# Altium schematic sheet Sheet_24V_PWR.SchDoc: Smart IoT Wallswitch
size A4; Author: Bc. Miroslav KAŽIMÍR; DrawnBy: Bc. Miroslav Kažimír; DocumentNumber: 24V to 5V DC/DC converter; SheetNumber: 1; SheetTotal: 1
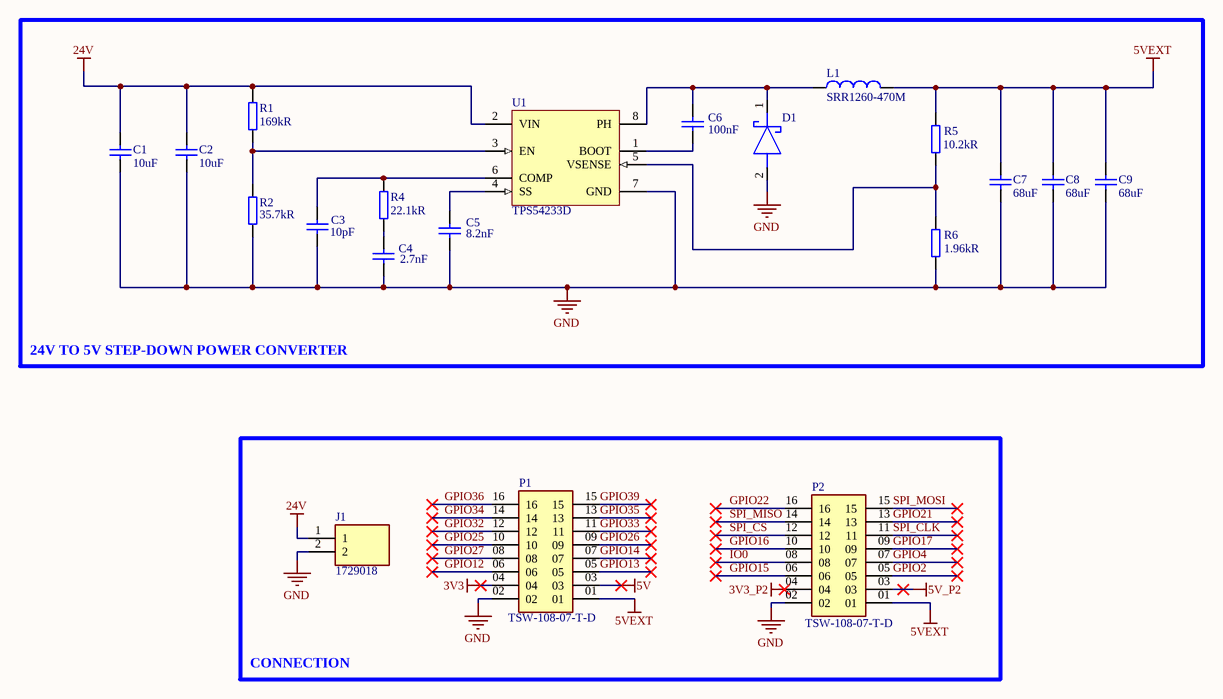
[diagram p0: Sheet_24V_PWR.SchDoc]

## Parts
C1  Capacitance: 10uF  [FP-C3225-250-0_4-IPC_A]  (hidden comment: C1210C106M5RACTU)
C2  Capacitance: 10uF  [FP-C3225-250-0_4-IPC_A]  (hidden comment: C1210C106M5RACTU)
C3  Capacitance: 10pF  [FP-C0805C-DN-IPC_A]  (hidden comment: C0805C100J5GACTU)
C4  Capacitance: 2.7nF  [FP-C2012-060-0_2-IPC_A]  (hidden comment: C2012C0G1H272J060AA)
C5  Capacitance: 8.2nF  [FP-C0805C-DN-IPC_A]  (hidden comment: C0805C822K4RACTU)
C6  Capacitance: 100nF  [FP-C0805C-DN-IPC_A]  (hidden comment: C0805C104K8RACTU)
C7  Capacitance: 68uF  [FP-C3216-160-0_3-IPC_A]  (hidden comment: C3216X5R1A686M160AC)
C8  Capacitance: 68uF  [FP-C3216-160-0_3-IPC_A]  (hidden comment: C3216X5R1A686M160AC)
C9  Capacitance: 68uF  [FP-C3216-160-0_3-IPC_A]  (hidden comment: C3216X5R1A686M160AC)
D1  SS2PH10-M3/84A  [DO-220AA]  (value not drawn)
J1  1729018  [1729018]
L1  SRR1260-470M  [SRR1260470M]
P1  TSW-108-07-T-D  [SAMTEC_TSW-108-07-T-D]
P2  TSW-108-07-T-D  [SAMTEC_TSW-108-07-T-D]
R1  Resistance: 169kR  [RESC2013X70X40LL20T20]  (hidden comment: ERJ-6ENF1693V)
R2  Resistance: 35.7kR  [RESC0805(2012)_L]  (hidden comment: CR0805-FX-3572ELF)
R4  Resistance: 22.1kR  [RESC2012X60N]  (hidden comment: CR0805-FX-2212ELF)
R5  Resistance: 10.2kR  [RESC2012X60N]  (hidden comment: CR0805-FX-1022ELF)
R6  Resistance: 1.96kR  [RESC2013X50X30LL20T20]  (hidden comment: CRCW08051K96FKEA)
U1  TPS54233D  [D0008A_L]

## Blocks framed on the sheet
24V TO 5V STEP-DOWN POWER CONVERTER: C1-C9 D1 L1 R1 R2 R4-R6 U1
CONNECTION: J1 P1 P2

## Nets
3V3: P1.04
3V3_P2: P2.04
5V: P1.03
5V_P2: P2.03
5VEXT: C7.1 C8.1 C9.1 L1.2 P1.01 P2.01 R5.1
24V: C1.1 C2.1 J1.1 R1.1 U1.2(VIN)
GND: C1.2 C2.2 C3.2 C4.2 C5.2 C7.2 C8.2 C9.2 D1.2(A) J1.2 P1.02 P2.02 R2.2 R6.2 U1.7(GND)
GPIO2: P2.05
GPIO4: P2.07
GPIO12: P1.06
GPIO13: P1.05
GPIO14: P1.07
GPIO15: P2.06
GPIO16: P2.10
GPIO17: P2.09
GPIO21: P2.13
GPIO22: P2.16
GPIO25: P1.10
GPIO26: P1.09
GPIO27: P1.08
GPIO32: P1.12
GPIO33: P1.11
GPIO34: P1.14
GPIO35: P1.13
GPIO36: P1.16
GPIO39: P1.15
IO0: P2.08
SPI_CLK: P2.11
SPI_CS: P2.12
SPI_MISO: P2.14
SPI_MOSI: P2.15
NetC3_1: C3.1 R4.1 U1.6(COMP)
NetC4_1: C4.1 R4.2
NetC5_1: C5.1 U1.4(SS)
NetC6_1: C6.1 D1.1(K) L1.1 U1.8(PH)
NetC6_2: C6.2 U1.1(BOOT)
NetR1_2: R1.2 R2.1 U1.3(EN)
NetR5_2: R5.2 R6.1 U1.5(VSENSE)

## Library data of the parts
C1 C2 = C1210C106M5RACTU: 3225 C 10uF Ceramic Multilayer Capacitor; 50 V; +85degC; X7R Dielectric; +/-20%; Manufacturer: KEMET; Voltage Rating: 50V; Tolerance: 20%; Supplier 1: Mouser; Manufacturer Part Number: C1210C106M5RACTU; RoHS: Yes; Category: Ceramic Capacitors; Stock 1: 269; Pricing 1: 1=1,11000, 10=0,85000, 50=0,85000, 100=0,60800, 500=0,54200, 1000=0,47500, 10000=0,47500 (USD); Mount: Surface Mount; Case/Package: 1210; Case Code (Metric): 3225; Case Code (Imperial): 1210; Weight: 0.000564oz; Dielectric Material: Ceramic; Min Operating Temperature: -55°C; Max Operating Temperature: 125°C; Packaging: Tape and Reel; Voltage: 50V; Dielectric: X7R; Termination: SMD/SMT; Voltage Rating (DC): 50V; Package Quantity: 1000; Length: 3.2mm; Width: 0.098inch; Height: 2.5mm; Thickness: 0.11inch; Depth: 2.5mm; RoHS Compliant: Yes; ComponentLink1URL: http://www.farnell.com/datasheets/2746479.pdf?src-supplier=Farnell; ComponentLink1Description: http://www.farnell.com/datasheets/2746479.pdf?src-supplier=Farnell; ComponentLink2URL: http://uk.rs-online.com/webdocs/1515/0900766b8151523a.pdf?src-supplier=RSComponents; ComponentLink2Description: http://uk.rs-online.com/webdocs/1515/0900766b8151523a.pdf?src-supplier=RSComponents; ComponentLink3URL: http://www.farnell.com/datasheets/2323917.pdf?src-supplier=Farnell; ComponentLink3Description: http://www.farnell.com/datasheets/2323917.pdf?src-supplier=Farnell; ComponentLink4URL: http://www.mouser.com/ds/2/212/KEM_C1002_X7R_SMD-357932.pdf?src-supplier=Mouser; ComponentLink4Description: http://www.mouser.com/ds/2/212/KEM_C1002_X7R_SMD-357932.pdf?src-supplier=Mouser; ComponentLink5URL: http://www.kemet.com/Lists/ProductCatalog/Attachments/53/KEM_C1002_X7R_SMD.pdf?src-supplier=Digi-Key; ComponentLink5Description: http://www.kemet.com/Lists/ProductCatalog/Attachments/53/KEM_C1002_X7R_SMD.pdf?src-supplier=Digi-Key; ComponentLink6URL: http://www.farnell.com/datasheets/2746479.pdf?src-supplier=Newark; ComponentLink6Description: http://www.farnell.com/datasheets/2746479.pdf?src-supplier=Newark; ComponentLink7URL: https://api.kemet.com/component-edge/download/datasheet/C1210C106M5RACTU.pdf?src-supplier=Digi-Key; ComponentLink7Description: https://api.kemet.com/component-edge/download/datasheet/C1210C106M5RACTU.pdf?src-supplier=Digi-Key; Supplier Part Number 1: 80-C1210C106M5R
C3 = C0805C100J5GACTU: Cap Ceramic 10pF 50V C0G 5% SMD 0805 125C Plastic T/R; Manufacturer: KEMET; Temperature Coefficient: 30ppm/°C; Dissipation Factor: 0.1%; Supplier 1: Mouser; Manufacturer Part Number: C0805C100J5GACTU; RoHS: Yes; Category: Ceramic Capacitors; Stock 1: 194709; Pricing 1: 1=0,12000, 10=0,04800, 50=0,04800, 100=0,03200, 500=0,02300, 1000=0,01900, 4000=0,01800, 8000=0,01500, 10000=0,01500 (USD); Mount: PCB,Surface Mount; Case/Package: 0805; Number of Pins: 2; Case Code (Metric): 2012; Case Code (Imperial): 0805; Contact Material: Tin; Contact Plating: Tin,Matte; Dielectric Material: Ceramic; Min Operating Temperature: -55°C; Max Operating Temperature: 125°C; Tolerance: 5%; Package Quantity: 4000; Voltage Rating: 50V; Packaging: Tape and Reel; Voltage Rating (DC): 50V; Dielectric: C0G; Termination: SMD/SMT; Voltage: 50V; Series: C0805C; Construction: Flat; Length: 2mm; Width: 1.2mm; Height: 0.78mm; Thickness: 0.035inch; Lead Pitch: 0.75mm; Depth: 1.25mm; Radiation Hardening: No; REACH SVHC: No SVHC; Lead Free: Lead Free; RoHS Compliant: Yes; ComponentLink1URL: https://datasheet.ciiva.com/6177/kem-c1003-c0g-smd-6177333.pdf?src-supplier=Farnell; ComponentLink1Description: https://datasheet.ciiva.com/6177/kem-c1003-c0g-smd-6177333.pdf?src-supplier=Farnell; ComponentLink2URL: https://datasheet.ciiva.com/14609/70095383-14609227.pdf?src-supplier=Allied+Electronics; ComponentLink2Description: https://datasheet.ciiva.com/14609/70095383-14609227.pdf?src-supplier=Allied+Electronics; ComponentLink3URL: https://datasheet.ciiva.com/5423/kem-c1003-c0g-smd-356956-5423483.pdf?src-supplier=Mouser; ComponentLink3Description: https://datasheet.ciiva.com/5423/kem-c1003-c0g-smd-356956-5423483.pdf?src-supplier=Mouser; ComponentLink4URL: https://datasheet.ciiva.com/2988/kem-c1003-c0g-smd-2988556.pdf?src-supplier=Avnet; ComponentLink4Description: https://datasheet.ciiva.com/2988/kem-c1003-c0g-smd-2988556.pdf?src-supplier=Avnet; Supplier Part Number 1: 80-C0805C100J5G
C4 = C2012C0G1H272J060AA: Cap Ceramic 0.0027uF 50V C0G 5% SMD 0805 125C Paper T/R; Manufacturer: TDK; Temperature Coefficient: 30ppm/°C; Supplier 1: Mouser; Manufacturer Part Number: C2012C0G1H272J060AA; RoHS: Yes; Category: Ceramic Capacitors; Stock 1: 7246; Pricing 1: 1=0,21000, 10=0,14700, 50=0,14700, 100=0,07000, 500=0,04900, 1000=0,04100, 2000=0,03800, 4000=0,03400, 8000=0,03100, 10000=0,03100 (USD); Mount: Surface Mount; Case/Package: 0805; Case Code (Imperial): 0805; Case Code (Metric): 2012; Weight: 0.000194oz; Dielectric Material: Ceramic; Min Operating Temperature: -55°C; Max Operating Temperature: 125°C; Packaging: Tape and Reel; Voltage Rating: 50V; Tolerance: 5%; Voltage Rating (DC): 50V; Termination: SMD/SMT; Construction: Flat; Package Quantity: 1; Dielectric: C0G; Voltage: 50V; Series: C; Length: 2mm; Width: 1.25mm; Height: 0.6mm; Thickness: 0.028inch; Depth: 1.25mm; Radiation Hardening: No; RoHS Compliant: Yes; Lead Free: Lead Free; ComponentLink1URL: https://datasheet.ciiva.com/24219/c2012c0g1h272j060aa-264945-24219106.pdf?src-supplier=Mouser; ComponentLink1Description: https://datasheet.ciiva.com/24219/c2012c0g1h272j060aa-264945-24219106.pdf?src-supplier=Mouser; ComponentLink2URL: https://datasheet.ciiva.com/11788/0900766b80c1bb00-11788104.pdf?src-supplier=RSComponents; ComponentLink2Description: https://datasheet.ciiva.com/11788/0900766b80c1bb00-11788104.pdf?src-supplier=RSComponents; ComponentLink3URL: https://datasheet.ciiva.com/26936/getdatasheetpartid-781773-26936472.pdf?src-supplier=Verical; ComponentLink3Description: https://datasheet.ciiva.com/26936/getdatasheetpartid-781773-26936472.pdf?src-supplier=Verical; ComponentLink4URL: https://datasheet.ciiva.com/6291/tdkmlcccaprange-6291707.pdf?src-supplier=Digi-Key; ComponentLink4Description: https://datasheet.ciiva.com/6291/tdkmlcccaprange-6291707.pdf?src-supplier=Digi-Key; ComponentLink5URL: https://datasheet.ciiva.com/6291/tdkmlcccaprange-6291704.pdf?src-supplier=Digi-Key; ComponentLink5Description: https://datasheet.ciiva.com/6291/tdkmlcccaprange-6291704.pdf?src-supplier=Digi-Key; ComponentLink6URL: https://datasheet.ciiva.com/6291/tdkmlcccaprange-6291710.pdf?src-supplier=Digi-Key; ComponentLink6Description: https://datasheet.ciiva.com/6291/tdkmlcccaprange-6291710.pdf?src-supplier=Digi-Key; Supplier Part Number 1: 810-C2012C0G1H272J-1
C5 = C0805C822K4RACTU: Capacitor, Ceramic, 8.2nF, 16VDC, 10-% Tol, 10+% Tol, X7R-TC Code, -15, 15%-TC RoHS Compliant: Yes; Manufacturer: KEMET; Tolerance: 10%; Voltage Rating: 16V; Dielectric: X7R; Dissipation Factor: 5%; Supplier 1: Mouser; Manufacturer Part Number: C0805C822K4RACTU; RoHS: Yes; Category: Ceramic Capacitors; Stock 1: 3964; Pricing 1: 1=0,31000, 10=0,21500, 50=0,21500, 100=0,12200, 1000=0,07500, 10000=0,06600 (USD); Mount: Surface Mount; Case/Package: 0805; Case Code (Metric): 2012; Case Code (Imperial): 0805; Dielectric Material: Ceramic; Min Operating Temperature: -55°C; Max Operating Temperature: 125°C; Packaging: Tape and Reel; Package Quantity: 4000; Voltage Rating (DC): 16V; Termination: SMD/SMT; Series: C; Length: 2mm; Width: 0.049inch; Height: 0.78mm; Thickness: 0.035inch; Lead Pitch: 0.75mm; Depth: 1.25mm; RoHS Compliant: Yes; ComponentLink1URL: http://www.mouser.com/ds/2/212/KEM_C1002_X7R_SMD-1102033.pdf?src-supplier=Mouser; ComponentLink1Description: http://www.mouser.com/ds/2/212/KEM_C1002_X7R_SMD-1102033.pdf?src-supplier=Mouser; ComponentLink2URL: http://components.arrow.com/part/dataview/3450560S8615350N7429?src-supplier=Arrow+Electronics; ComponentLink2Description: http://components.arrow.com/part/dataview/3450560S8615350N7429?src-supplier=Arrow+Electronics; ComponentLink3URL: https://search.kemet.com/component-edge/download/datasheet/C0805C822K4RACTU.pdf?src-supplier=Digi-Key; ComponentLink3Description: https://search.kemet.com/component-edge/download/datasheet/C0805C822K4RACTU.pdf?src-supplier=Digi-Key; Supplier Part Number 1: 80-C0805C822K4R
C6 = C0805C104K8RACTU: Cap Ceramic 0.1uF 10V X7R 10% SMD 0805 125°C Paper T/R; Manufacturer: KEMET; Dissipation Factor: 5%; Supplier 1: Mouser; Manufacturer Part Number: C0805C104K8RACTU; RoHS: Yes; Category: Ceramic Capacitors; Stock 1: 26277; Pricing 1: 1=0,18000, 10=0,08600, 50=0,08600, 100=0,08600, 1000=0,08600, 10000=0,08500 (USD); Mount: Surface Mount; Case/Package: 0805; Case Code (Imperial): 0805; Case Code (Metric): 2012; Dielectric Material: Ceramic; Min Operating Temperature: -55°C; Max Operating Temperature: 125°C; Package Quantity: 1; Tolerance: 10%; Packaging: Tape and Reel; Voltage Rating: 10V; Voltage Rating (DC): 10V; Dielectric: X7R; Termination: SMD/SMT; Series: C; Length: 2mm; Width: 1.2mm; Height: 0.9mm; Lead Pitch: 0.75mm; Thickness: 0.035inch; Depth: 1.25mm; REACH SVHC: No SVHC; RoHS Compliant: Yes; ComponentLink1URL: http://components.arrow.com/part/dataview/2091095S5871853N7429?src-supplier=Arrow+Electronics; ComponentLink1Description: http://components.arrow.com/part/dataview/2091095S5871853N7429?src-supplier=Arrow+Electronics; ComponentLink2URL: http://www.farnell.com/datasheets/2323363.pdf?src-supplier=Farnell; ComponentLink2Description: http://www.farnell.com/datasheets/2323363.pdf?src-supplier=Farnell; ComponentLink3URL: http://www.mouser.com/ds/2/212/KEM_C1002_X7R_SMD-1102033.pdf?src-supplier=Mouser; ComponentLink3Description: http://www.mouser.com/ds/2/212/KEM_C1002_X7R_SMD-1102033.pdf?src-supplier=Mouser; ComponentLink4URL: http://www.farnell.com/datasheets/2746328.pdf?src-supplier=Farnell; ComponentLink4Description: http://www.farnell.com/datasheets/2746328.pdf?src-supplier=Farnell; ComponentLink5URL: http://www.farnell.com/datasheets/2746328.pdf?src-supplier=Newark; ComponentLink5Description: http://www.farnell.com/datasheets/2746328.pdf?src-supplier=Newark; ComponentLink6URL: https://api.kemet.com/component-edge/download/datasheet/C0805C104K8RACTU.pdf?src-supplier=Digi-Key; ComponentLink6Description: https://api.kemet.com/component-edge/download/datasheet/C0805C104K8RACTU.pdf?src-supplier=Digi-Key; Supplier Part Number 1: 80-C0805C104K8R
C7-C9 = C3216X5R1A686M160AC: C Series 1206 68 uF 10 V ±20 % Tolerance X5R SMT Multilayer Ceramic Capacitor; Manufacturer: TDK; Tolerance: 20%; Voltage Rating: 10V; Supplier 1: Mouser; Manufacturer Part Number: C3216X5R1A686M160AC; RoHS: Yes; Category: Ceramic Capacitors; Stock 1: 21577; Pricing 1: 1=1,39000, 10=0,98700, 50=0,98700, 100=0,84800, 500=0,64600, 1000=0,57000, 2000=0,53100, 4000=0,51500, 10000=0,49900, 24000=0,48400 (USD); Mount: Surface Mount; Case/Package: 1206; Case Code (Metric): 3216; Case Code (Imperial): 1206; Dielectric Material: Ceramic; Min Operating Temperature: -55°C; Max Operating Temperature: 85°C; Package Quantity: 2000; Packaging: Tape and Reel; Termination: SMD/SMT; Resistor Type: Ceramic; Voltage Rating (DC): 10V; Series: C; Dielectric: X5R; Length: 0.126inch; Width: 1.6mm; Height: 1.6mm; Thickness: 0.071inch; Lead Free: Lead Free; RoHS Compliant: Yes; ComponentLink1URL: http://www.mouser.com/ds/2/400/tdk_mlcc_commercial_general_en-542463.pdf?src-supplier=Mouser; ComponentLink1Description: http://www.mouser.com/ds/2/400/tdk_mlcc_commercial_general_en-542463.pdf?src-supplier=Mouser; ComponentLink2URL: http://www.farnell.com/datasheets/2792994.pdf?src-supplier=Farnell; ComponentLink2Description: http://www.farnell.com/datasheets/2792994.pdf?src-supplier=Farnell; ComponentLink3URL: https://product.tdk.com/info/en/documents/chara_sheet/C3216X5R1A686M160AC.pdf?src-supplier=Digi-Key; ComponentLink3Description: https://product.tdk.com/info/en/documents/chara_sheet/C3216X5R1A686M160AC.pdf?src-supplier=Digi-Key; ComponentLink4URL: http://www.farnell.com/datasheets/2370676.pdf?src-supplier=Newark; ComponentLink4Description: http://www.farnell.com/datasheets/2370676.pdf?src-supplier=Newark; ComponentLink5URL: https://product.tdk.com/en/products/common/pdf/mlcc_partnumber_description.pdf?src-supplier=Digi-Key; ComponentLink5Description: https://product.tdk.com/en/products/common/pdf/mlcc_partnumber_description.pdf?src-supplier=Digi-Key; ComponentLink6URL: http://product.tdk.com/en/catalog/datasheets/mlcc_commercial_general_en.pdf?src-supplier=Avnet; ComponentLink6Description: http://product.tdk.com/en/catalog/datasheets/mlcc_commercial_general_en.pdf?src-supplier=Avnet; Supplier Part Number 1: 810-C3216X5R1A686M1C
D1 = SS2PH10-M3/84A: DIODE SCHOTTKY 100V 2A DO220AA; Manufacturer: Vishay; Max Reverse Current: 1uA; Peak Non-Repetitive Surge Current: 50A; Element Configuration: Single; Forward Voltage: 800mV; Supplier 1: Mouser; Manufacturer Part Number: SS2PH10-M3/84A; RoHS: Yes; Category: Rectifier Diodes; Stock 1: 5780; Pricing 1: 1=0,48000, 10=0,39800, 50=0,39800, 100=0,27100, 1000=0,15300, 10000=0,13900 (USD); Mount: Surface Mount; Case/Package: DO-220AA; Number of Pins: 2; Contact Plating: Tin,Matte; Min Operating Temperature: -55°C; Max Operating Temperature: 175°C; Packaging: Tape and Reel; Forward Current: 2A; Package Quantity: 1; Average Rectified Current: 2A; Max Repetitive Reverse Voltage (Vrrm): 100V; Max Reverse Voltage (DC): 100V; Max Surge Current: 50A; Max Forward Surge Current (Ifsm): 50A; Series: eSMP®; Radiation Hardening: No; REACH SVHC: Unknown; RoHS Compliant: Yes; Lead Free: Lead Free; ComponentLink1URL: https://datasheet.ciiva.com/18567/ss2ph920&20ss2ph10-18567489.pdf?src-supplier=Digi-Key; ComponentLink1Description: https://datasheet.ciiva.com/18567/ss2ph920&20ss2ph10-18567489.pdf?src-supplier=Digi-Key; ComponentLink2URL: https://datasheet.ciiva.com/7962/ss2ph9-7962425.pdf?src-supplier=Element14; ComponentLink2Description: https://datasheet.ciiva.com/7962/ss2ph9-7962425.pdf?src-supplier=Element14; ComponentLink3URL: https://datasheet.ciiva.com/22695/1911775-22695932.pdf?src-supplier=Element14; ComponentLink3Description: https://datasheet.ciiva.com/22695/1911775-22695932.pdf?src-supplier=Element14; ComponentLink4URL: https://datasheet.ciiva.com/8289/ss2ph9-8289129.pdf?src-supplier=Avnet; ComponentLink4Description: https://datasheet.ciiva.com/8289/ss2ph9-8289129.pdf?src-supplier=Avnet; ComponentLink5URL: https://datasheet.ciiva.com/13948/ss2ph9-13948536.pdf?src-supplier=Digi-Key; ComponentLink5Description: https://datasheet.ciiva.com/13948/ss2ph9-13948536.pdf?src-supplier=Digi-Key; ComponentLink6URL: https://datasheet.ciiva.com/15045/ss2ph9ss2ph10-15045638.pdf?src-supplier=Digi-Key; ComponentLink6Description: https://datasheet.ciiva.com/15045/ss2ph9ss2ph10-15045638.pdf?src-supplier=Digi-Key; Supplier Part Number 1: 625-SS2PH10-M3
J1 = 1729018: 间距5mm 2pin 10A 300V 可拼接 螺钉式 直插; Manufacturer: Phoenix Contact; Current Rating: 13.5A; Number of Positions: 2; Voltage Rating: 400V; Number of Levels: 1; Gender: Male; Max Supply Voltage: 250V; Connector Type: Screw; Wire Gauge (Max): 26AWG; Pitch: 5mm; Stripping Length: 6mm; Approvals: UL,CSA,cULus,CB,EAC; Supplier 1: Mouser; Manufacturer Part Number: 1729018; RoHS: Yes; Category: Terminal Blocks; Stock 1: 15002; Pricing 1: 1=1,21000, 10=1,17000, 50=1,12000, 100=1,08000, 250=1,01000, 500=0,92900, 1000=0,85800, 2500=0,81800, 5000=0,76700, 10000=0,76700 (USD); Mount: Through Hole; Number of Pins: 2; Weight: 0.06949oz; Color: Green; Material: Polyamide; Housing Color: Green; Housing Material: Polyamide; Contact Material: Tin; Insulation Material: Nylon; Package Quantity: 50; Packaging: Bulk; Termination: Screw; Number of Positions Per Level: 2; Current: 10A; Number of Contacts: 2; Series: COMBICON MKDSN; Number of Rows: 1; Max Current Rating: 13.5A; Number of Poles: 2; Voltage: 300V; Number of Circuits: 2; Orientation: Straight; Length: 8.1mm; Width: 13.5mm; Height: 13.5mm; Wire Gauge (Min): 26AWG; Depth: 8.1mm; Wire/Cable Gauge: 26AWG; Radiation Hardening: No; REACH SVHC: Unknown; RoHS Compliant: Yes; Lead Free: Lead Free; Flammability Rating: UL94 V-0; ComponentLink1URL: https://datasheet.ciiva.com/16071/1729018-16071814.pdf?src-supplier=Onlinecomponents.com; ComponentLink1Description: https://datasheet.ciiva.com/16071/1729018-16071814.pdf?src-supplier=Onlinecomponents.com; ComponentLink2URL: https://datasheet.ciiva.com/15169/getdatasheetpartid-177860-15169643.pdf?src-supplier=Verical; ComponentLink2Description: https://datasheet.ciiva.com/15169/getdatasheetpartid-177860-15169643.pdf?src-supplier=Verical; ComponentLink3URL: https://datasheet.ciiva.com/832/1729018-832055.pdf?src-supplier=Digi-Key; ComponentLink3Description: https://datasheet.ciiva.com/832/1729018-832055.pdf?src-supplier=Digi-Key; ComponentLink4URL: https://datasheet.ciiva.com/14607/70054375-14607356.pdf?src-supplier=Allied+Electronics; ComponentLink4Description: https://datasheet.ciiva.com/14607/70054375-14607356.pdf?src-supplier=Allied+Electronics; ComponentLink5URL: https://datasheet.ciiva.com/33105/1729018-33105978.pdf?src-supplier=Today+Components; ComponentLink5Description: https://datasheet.ciiva.com/33105/1729018-33105978.pdf?src-supplier=Today+Components; Supplier Part Number 1: 651-1729018
L1 = SRR1260-470M: Inductor Power Shielded Wirewound 47uH 20% 100KHz 22Q-Factor Ferrite 2.6A 86mOhm DCR T/R; Manufacturer: Bourns; Material: Steel; Self Resonant Frequency: 7.63MHz; Saturation Current: 2.5A; DC Resistance (DCR): 86mR; Q Factor: 22; Supplier 1: Mouser; Manufacturer Part Number: SRR1260-470M; RoHS: Yes; Category: Fixed Inductors; Stock 1: 4692; Pricing 1: 1=1,36000, 10=1,02000, 50=1,02000, 100=0,91300, 1000=0,69900, 10000=0,52900 (USD); Mount: Surface Mount; Case/Package: 1260; Core Material: Ferrite; Min Operating Temperature: -40°C; Max Operating Temperature: 125°C; Tolerance: 20%; Inductance: 47uH; Max DC Current: 2.6A; Series: SRR1260; Inductance Tolerance: 20%; Packaging: Tape and Reel; Package Quantity: 600; Current Rating: 2.6A; Shielding: Shielded; Test Frequency: 100kHz; Termination: SMD/SMT; RMS Current (Irms): 2.6A; Resistor Type: Wirewound; DC Current: 2.6A; Frequency: 7.63MHz; Resistance: 86MR; Sample Rate (Hz): 100kHz; Length: 12.5mm; Width: 12.5mm; Height: 6mm; Depth: 12.8mm; Height - Seated (Max): 0.256inch; Radiation Hardening: No; RoHS Compliant: Yes; REACH SVHC: No SVHC; Military Standard: Not; ComponentLink1URL: https://datasheet.ciiva.com/11799/0900766b80defded-11799944.pdf?src-supplier=RSComponents; ComponentLink1Description: https://datasheet.ciiva.com/11799/0900766b80defded-11799944.pdf?src-supplier=RSComponents; ComponentLink2URL: https://datasheet.ciiva.com/1062/srr1260-1062578.pdf?src-supplier=Digi-Key; ComponentLink2Description: https://datasheet.ciiva.com/1062/srr1260-1062578.pdf?src-supplier=Digi-Key; ComponentLink3URL: https://datasheet.ciiva.com/1062/srr1260-1062579.pdf?src-supplier=Digi-Key; ComponentLink3Description: https://datasheet.ciiva.com/1062/srr1260-1062579.pdf?src-supplier=Digi-Key; ComponentLink4URL: https://datasheet.ciiva.com/1062/srr1260-1062580.pdf?src-supplier=Digi-Key; ComponentLink4Description: https://datasheet.ciiva.com/1062/srr1260-1062580.pdf?src-supplier=Digi-Key; ComponentLink5URL: https://datasheet.ciiva.com/8517/srr1260-8517158.pdf?src-supplier=Avnet; ComponentLink5Description: https://datasheet.ciiva.com/8517/srr1260-8517158.pdf?src-supplier=Avnet; ComponentLink6URL: https://datasheet.ciiva.com/17111/70277056-17111735.pdf?src-supplier=Allied+Electronics; ComponentLink6Description: https://datasheet.ciiva.com/17111/70277056-17111735.pdf?src-supplier=Allied+Electronics; ComponentLink7URL: https://datasheet.ciiva.com/46384/1430852-46384136.pdf?src-supplier=Element14; ComponentLink7Description: https://datasheet.ciiva.com/46384/1430852-46384136.pdf?src-supplier=Element14; ComponentLink8URL: https://datasheet.ciiva.com/6161/1430852-6161177.pdf?src-supplier=Farnell; ComponentLink8Description: https://datasheet.ciiva.com/6161/1430852-6161177.pdf?src-supplier=Farnell; ComponentLink9URL: https://datasheet.ciiva.com/7849/1430852-7849786.pdf?src-supplier=Element14; ComponentLink9Description: https://datasheet.ciiva.com/7849/1430852-7849786.pdf?src-supplier=Element14; ComponentLink10URL: https://datasheet.ciiva.com/48684/srr1260-48684894.pdf?src-supplier=Avnet; ComponentLink10Description: https://datasheet.ciiva.com/48684/srr1260-48684894.pdf?src-supplier=Avnet; ComponentLink11URL: https://datasheet.ciiva.com/7307/1914016-7307759.pdf?src-supplier=Newark; ComponentLink11Description: https://datasheet.ciiva.com/7307/1914016-7307759.pdf?src-supplier=Newark; ComponentLink12URL: https://datasheet.ciiva.com/48690/001056651-da-01-en-mag-abge-l-ind-srr1260-470m-47uh-2-6a-48690779.pdf?src-supplier=Conrad; ComponentLink12Description: https://datasheet.ciiva.com/48690/001056651-da-01-en-mag-abge-l-ind-srr1260-470m-47uh-2-6a-48690779.pdf?src-supplier=Conrad; Supplier Part Number 1: 652-SRR1260-470M
P1 P2 = TSW-108-07-T-D: Conn Unshrouded Header HDR 16 POS 2.54mm Solder ST Thru-Hole Bulk; Manufacturer: Samtec; Gender: Male; Number of Contacts: 16; Max Current Rating: 7.6A; Max Voltage Rating (AC): 550V; Connector Type: Male Pin; Row Spacing: 0.1inch; Supplier 1: Mouser; Manufacturer Part Number: TSW-108-07-T-D; RoHS: Yes; Category: Connectors; Stock 1: 9900; Pricing 1: 1=1,38000, 10=1,24000, 50=1,24000, 100=1,07000, 500=0,89200, 1000=0,76400, 2500=0,70700, 5000=0,67800, 10000=0,66200, 25000=0,64700 (USD); Mount: Through Hole; Contact Material: Bronze; Contact Plating: Tin; Housing Material: Polyester; Housing Color: Black; Color: Black; Min Operating Temperature: -55°C; Max Operating Temperature: 105°C; Number of Rows: 2; Termination: Solder; Packaging: Bulk; Orientation: Straight; Number of Positions: 16; Package Quantity: 1; Length: 20.32mm; Width: 5.08mm; Pitch: 2.54mm; Depth: 5.08mm; Contact Mating Length: 0.23inch; Radiation Hardening: No; REACH SVHC: No SVHC; Lead Free: Lead Free; ComponentLink1URL: https://datasheet.ciiva.com/6886/tsw-xxx-xx-xxx-x-xx-xxx-mkt-6886341.pdf?src-supplier=Digi-Key; ComponentLink1Description: https://datasheet.ciiva.com/6886/tsw-xxx-xx-xxx-x-xx-xxx-mkt-6886341.pdf?src-supplier=Digi-Key; ComponentLink2URL: https://datasheet.ciiva.com/10267/htsw-th-10267287.pdf?src-supplier=Avnet; ComponentLink2Description: https://datasheet.ciiva.com/10267/htsw-th-10267287.pdf?src-supplier=Avnet; ComponentLink3URL: https://datasheet.ciiva.com/10265/htsw-th-10265257.pdf?src-supplier=Avnet; ComponentLink3Description: https://datasheet.ciiva.com/10265/htsw-th-10265257.pdf?src-supplier=Avnet; Supplier Part Number 1: 200-TSW10807TD
R1 = ERJ-6ENF1693V: Res Thick Film 0805 169K Ohm 1% 1/8W ±100ppm/°C Molded SMD Punched Carrier T/R; Manufacturer: Panasonic; Power Rating: 125mW; Voltage Rating: 150V; Supplier 1: Mouser; Manufacturer Part Number: ERJ-6ENF1693V; RoHS: Yes; Category: Chip SMD Resistors; Stock 1: 26412; Pricing 1: 1=0,10000, 10=0,06400, 50=0,06400, 100=0,03100, 1000=0,01700, 10000=0,01100 (USD); Mount: Surface Mount; Case/Package: 0805; Contact Plating: Tin; Case Code (Imperial): 0805; Case Code (Metric): 2012; Min Operating Temperature: -55°C; Max Operating Temperature: 155°C; Tolerance: 1%; Resistor Type: Thick Film; Temperature Coefficient: 100ppm/°C; Packaging: Tape and Reel; Package Quantity: 1; Number of Terminations: 2; Termination: Solder; Max Power Dissipation: 125mW; Voltage Rating (DC): 150V; Features: Automotive AEC-Q200; Series: ERJ; Resistance Tolerance: 1%; Technology: THICK FILM; Construction: Rectangular; Length: 2mm; Width: 1.2mm; Height: 0.6mm; Depth: 1.25mm; Radiation Hardening: No; REACH SVHC: No SVHC; Military Standard: Not; Lead Free: Lead Free; RoHS Compliant: Yes; ComponentLink1URL: https://datasheet.ciiva.com/16759/70260748-16759800.pdf?src-supplier=Allied+Electronics; ComponentLink1Description: https://datasheet.ciiva.com/16759/70260748-16759800.pdf?src-supplier=Allied+Electronics; ComponentLink2URL: https://datasheet.ciiva.com/22672/1678782-22672876.pdf?src-supplier=Element14; ComponentLink2Description: https://datasheet.ciiva.com/22672/1678782-22672876.pdf?src-supplier=Element14; ComponentLink3URL: https://datasheet.ciiva.com/16764/70260748-16764845.pdf?src-supplier=Allied+Electronics; ComponentLink3Description: https://datasheet.ciiva.com/16764/70260748-16764845.pdf?src-supplier=Allied+Electronics; ComponentLink4URL: https://datasheet.ciiva.com/46373/1678782-46373037.pdf?src-supplier=Element14; ComponentLink4Description: https://datasheet.ciiva.com/46373/1678782-46373037.pdf?src-supplier=Element14; ComponentLink5URL: https://datasheet.ciiva.com/46373/1678782-46373038.pdf?src-supplier=Element14; ComponentLink5Description: https://datasheet.ciiva.com/46373/1678782-46373038.pdf?src-supplier=Element14; Supplier Part Number 1: 667-ERJ-6ENF1693V
R2 = CR0805-FX-3572ELF: Res Thick Film 0805 35.7K Ohm 1% 1/8W 100ppm/C Molded SMD SMD Paper Tape on Plastic Reel; Manufacturer: Bourns; Power Rating: 125mW; Voltage Rating: 150V; Temperature Coefficient: 100ppm/°C; Supplier 1: Mouser; Manufacturer Part Number: CR0805-FX-3572ELF; RoHS: Yes; Category: Chip SMD Resistors; Stock 1: 40799; Pricing 1: 1=0,10000, 10=0,05000, 50=0,05000, 100=0,02100, 1000=0,01000, 10000=0,00500 (USD); Mount: Surface Mount; Case/Package: 0805; Case Code (Metric): 2012; Case Code (Imperial): 0805; Contact Plating: Tin; Min Operating Temperature: -55°C; Max Operating Temperature: 155°C; Packaging: Tape and Reel; Tolerance: 1%; Package Quantity: 5000; Resistor Type: Thick Film; Number of Terminations: 2; Termination: SMD/SMT; Max Power Dissipation: 125mW; Features: Moisture Resistant; Series: CR0805; Length: 0.079inch; Width: 0.049inch; Height: 0.024inch; Thickness: 508um; Radiation Hardening: No; RoHS Compliant: Yes; ComponentLink1URL: https://datasheet.ciiva.com/14985/chpreztr-14985829.pdf?src-supplier=Digi-Key; ComponentLink1Description: https://datasheet.ciiva.com/14985/chpreztr-14985829.pdf?src-supplier=Digi-Key; ComponentLink2URL: https://datasheet.ciiva.com/5543/chpreztr-5543310.pdf?src-supplier=Mouser; ComponentLink2Description: https://datasheet.ciiva.com/5543/chpreztr-5543310.pdf?src-supplier=Mouser; ComponentLink3URL: https://datasheet.ciiva.com/9121/chpreztr-9121519.pdf?src-supplier=Avnet; ComponentLink3Description: https://datasheet.ciiva.com/9121/chpreztr-9121519.pdf?src-supplier=Avnet; Supplier Part Number 1: 652-CR0805FX-3572ELF
R4 = CR0805-FX-2212ELF: Res Thick Film 0805 22.1K Ohm 1% 1/8W ±100ppm/°C Molded SMD SMD Paper Tape on Plastic Reel; Manufacturer: Bourns; Power Rating: 125mW; Voltage Rating: 150V; Supplier 1: Mouser; Manufacturer Part Number: CR0805-FX-2212ELF; RoHS: Yes; Category: Chip SMD Resistors; Stock 1: 28517; Pricing 1: 1=0,10000, 10=0,02700, 50=0,02700, 100=0,01100, 1000=0,00500, 10000=0,00500 (USD); Mount: Surface Mount; Case/Package: 0805; Contact Plating: Tin; Case Code (Imperial): 0805; Case Code (Metric): 2012; Min Operating Temperature: -55°C; Max Operating Temperature: 155°C; Tolerance: 1%; Resistor Type: Thick Film; Temperature Coefficient: 100ppm/°C; Packaging: Tape and Reel; Package Quantity: 5000; Termination: SMD/SMT; Number of Terminations: 2; Max Power Dissipation: 125mW; Features: Moisture Resistant; Series: CR0805; Construction: Rectangular; Length: 2mm; Width: 1.25mm; Height: 0.024inch; Depth: 1.25mm; Thickness: 508um; Radiation Hardening: No; Military Standard: Not; RoHS Compliant: Yes; ComponentLink1URL: https://datasheet.ciiva.com/18608/chpreztr-18608486.pdf?src-supplier=Digi-Key; ComponentLink1Description: https://datasheet.ciiva.com/18608/chpreztr-18608486.pdf?src-supplier=Digi-Key; ComponentLink2URL: https://datasheet.ciiva.com/18608/chpreztr-18608487.pdf?src-supplier=Digi-Key; ComponentLink2Description: https://datasheet.ciiva.com/18608/chpreztr-18608487.pdf?src-supplier=Digi-Key; ComponentLink3URL: https://datasheet.ciiva.com/18608/chpreztr-18608488.pdf?src-supplier=Digi-Key; ComponentLink3Description: https://datasheet.ciiva.com/18608/chpreztr-18608488.pdf?src-supplier=Digi-Key; ComponentLink4URL: https://datasheet.ciiva.com/3205/chpreztr-3205695.pdf?src-supplier=Avnet; ComponentLink4Description: https://datasheet.ciiva.com/3205/chpreztr-3205695.pdf?src-supplier=Avnet; Supplier Part Number 1: 652-CR0805FX-2212ELF
R5 = CR0805-FX-1022ELF: Res Thick Film 0805 10.2K Ohm 1% 1/8W ±100ppm/°C Molded SMD SMD Paper Tape on Plastic Reel; Manufacturer: Bourns; Power Rating: 125mW; Voltage Rating: 150V; Supplier 1: Mouser; Manufacturer Part Number: CR0805-FX-1022ELF; RoHS: Yes; Category: Chip SMD Resistors; Stock 1: 45271; Pricing 1: 1=0,10000, 10=0,05000, 50=0,05000, 100=0,02100, 1000=0,01000, 10000=0,00500 (USD); Mount: Surface Mount; Case/Package: 0805; Case Code (Metric): 2012; Case Code (Imperial): 0805; Contact Plating: Tin; Min Operating Temperature: -55°C; Max Operating Temperature: 155°C; Tolerance: 1%; Packaging: Tape and Reel; Package Quantity: 5000; Resistor Type: Thick Film; Number of Terminations: 2; Termination: SMD/SMT; Temperature Coefficient: 100ppm/°C; Max Power Dissipation: 125mW; Features: Moisture Resistant; Series: CR0805; Construction: Rectangular; Length: 2mm; Width: 0.049inch; Height: 0.024inch; Depth: 1.25mm; Thickness: 508um; Radiation Hardening: No; Military Standard: Not; RoHS Compliant: Yes; ComponentLink1URL: https://datasheet.ciiva.com/14986/chpreztr-14986043.pdf?src-supplier=Digi-Key; ComponentLink1Description: https://datasheet.ciiva.com/14986/chpreztr-14986043.pdf?src-supplier=Digi-Key; ComponentLink2URL: https://datasheet.ciiva.com/9122/chpreztr-9122286.pdf?src-supplier=Avnet; ComponentLink2Description: https://datasheet.ciiva.com/9122/chpreztr-9122286.pdf?src-supplier=Avnet; Supplier Part Number 1: 652-CR0805FX-1022ELF
R6 = CRCW08051K96FKEA: Res Thick Film 0805 1.96K Ohm 1% 1/8W ±100ppm/°C Molded SMD SMD Paper T/R; Manufacturer: Vishay; Max Power Dissipation: 125mW; Voltage Rating: 150V; Supplier 1: Mouser; Manufacturer Part Number: CRCW08051K96FKEA; RoHS: Yes; Category: Chip SMD Resistors; Stock 1: 18581; Pricing 1: 1=0,18000, 10=0,06500, 50=0,06500, 100=0,02700, 1000=0,01300, 10000=0,00900 (USD); Case/Package: 0805; Number of Pins: 2; Weight: 0.000194oz; Case Code (Imperial): 0805; Case Code (Metric): 2012; Contact Plating: Tin; Size Code: 0805; Min Operating Temperature: -55°C; Max Operating Temperature: 155°C; Tolerance: 1%; Packaging: Tape and Reel; Package Quantity: 10; Resistor Type: Thick Film; Number of Terminations: 2; Temperature Coefficient: 100ppm/°C; Features: Automotive AEC-Q200; Series: CRCW; Power Rating: 125mW; Termination: SMD/SMT; Voltage Rating (DC): 150V; Resistance Tolerance: 1%; Technology: THICK FILM; Construction: Rectangular; Length: 2mm; Width: 1.25mm; Height: 0.45mm; Depth: 1.25mm; Radiation Hardening: No; Lead Free: Lead Free; RoHS Compliant: Yes; REACH SVHC: Unknown; Military Standard: Not; ComponentLink1URL: https://datasheet.ciiva.com/11810/0900766b80d98b26-11810985.pdf?src-supplier=RSComponents; ComponentLink1Description: https://datasheet.ciiva.com/11810/0900766b80d98b26-11810985.pdf?src-supplier=RSComponents; ComponentLink2URL: https://datasheet.ciiva.com/7670/1697337-7670278.pdf?src-supplier=Element14; ComponentLink2Description: https://datasheet.ciiva.com/7670/1697337-7670278.pdf?src-supplier=Element14; ComponentLink3URL: https://datasheet.ciiva.com/16211/dcrcwe3-16211959.pdf?src-supplier=Future+Electronics; ComponentLink3Description: https://datasheet.ciiva.com/16211/dcrcwe3-16211959.pdf?src-supplier=Future+Electronics; ComponentLink4URL: https://datasheet.ciiva.com/2496/dcrcwe3-2496058.pdf?src-supplier=Digi-Key; ComponentLink4Description: https://datasheet.ciiva.com/2496/dcrcwe3-2496058.pdf?src-supplier=Digi-Key; ComponentLink5URL: https://datasheet.ciiva.com/2496/dcrcwe3-2496059.pdf?src-supplier=Digi-Key; ComponentLink5Description: https://datasheet.ciiva.com/2496/dcrcwe3-2496059.pdf?src-supplier=Digi-Key; ComponentLink6URL: https://datasheet.ciiva.com/2496/dcrcwe3-2496060.pdf?src-supplier=Digi-Key; ComponentLink6Description: https://datasheet.ciiva.com/2496/dcrcwe3-2496060.pdf?src-supplier=Digi-Key; Supplier Part Number 1: 71-CRCW08051K96FKEA
U1 = TPS54233D: 3.5 to 28V Input, 2A, 300kHz Step-Down Converter with Eco-mode 8-SOIC -40 to 150; Manufacturer: Texas Instruments; Output Voltage: 25V; Number of Outputs: 1; Min Input Voltage: 3.5V; Min Output Voltage: 800mV; Synchronous Rectifier: No; Quiescent Current: 110uA; Output Type: Adjustable; Output Configuration: Positive; Supplier 1: Mouser; Manufacturer Part Number: TPS54233D; RoHS: Yes; Category: Voltage Regulators - Switching; Stock 1: 4197; Pricing 1: 1=2,13000, 10=1,92000, 25=1,81000, 50=1,81000, 100=1,54000, 250=1,44000, 375=1,26000, 1000=1,26000, 1125=1,05000, 10000=1,05000 (USD); Case/Package: D; Number of Pins: 8; Weight: 0.002561oz; Contact Plating: Gold; Min Operating Temperature: -40°C; Max Operating Temperature: 150°C; Packaging: Rail/Tube; Switching Frequency: 300kHz; Output Current: 2A; Package Quantity: 75; Max Output Current: 2A; Max Input Voltage: 28V; Max Output Voltage: 25V; Operating Supply Voltage: 28V; Series: SWIFT™, Eco-Mode™; Length: 4.9mm; Width: 3.91mm; Height: 1.58mm; Radiation Hardening: No; Lead Free: Lead Free; RoHS Compliant: Yes; REACH SVHC: No SVHC; ComponentLink1URL: https://datasheet.ciiva.com/2035/tps54233-2035392.pdf?src-supplier=Digi-Key; ComponentLink1Description: https://datasheet.ciiva.com/2035/tps54233-2035392.pdf?src-supplier=Digi-Key; ComponentLink2URL: https://datasheet.ciiva.com/4118/47079537s8453800n7713-4118932.pdf?src-supplier=Arrow+Electronics; ComponentLink2Description: https://datasheet.ciiva.com/4118/47079537s8453800n7713-4118932.pdf?src-supplier=Arrow+Electronics; Supplier Part Number 1: 595-TPS54233D